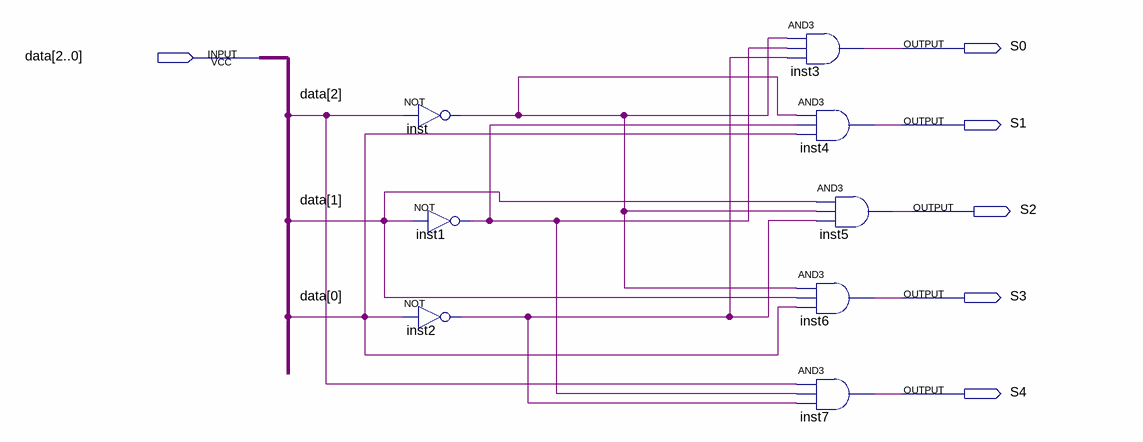
[diagram p0: schematic sheet]
// Quartus schematic decoder3_5.bdf as structural Verilog: 8 symbols, 6 pins
module decoder3_5 (
  input  [2:0] data,
  output S0,
  output S1,
  output S2,
  output S3,
  output S4
);

  wire inst1_out, inst2_out, inst_out;

  not inst (inst_out, data[2]);
  not inst1 (inst1_out, data[1]);
  not inst2 (inst2_out, data[0]);
  and inst3 (S0, inst_out, inst1_out, inst2_out);
  and inst4 (S1, inst_out, inst1_out, data[0]);
  and inst5 (S2, data[1], inst_out, inst2_out);
  and inst6 (S3, inst_out, data[1], data[0]);
  and inst7 (S4, data[2], inst1_out, inst2_out);
endmodule
